# EAGLE schematic 1_axis_stepper_driver_teensy_v39 (EAGLE 9.7.0)
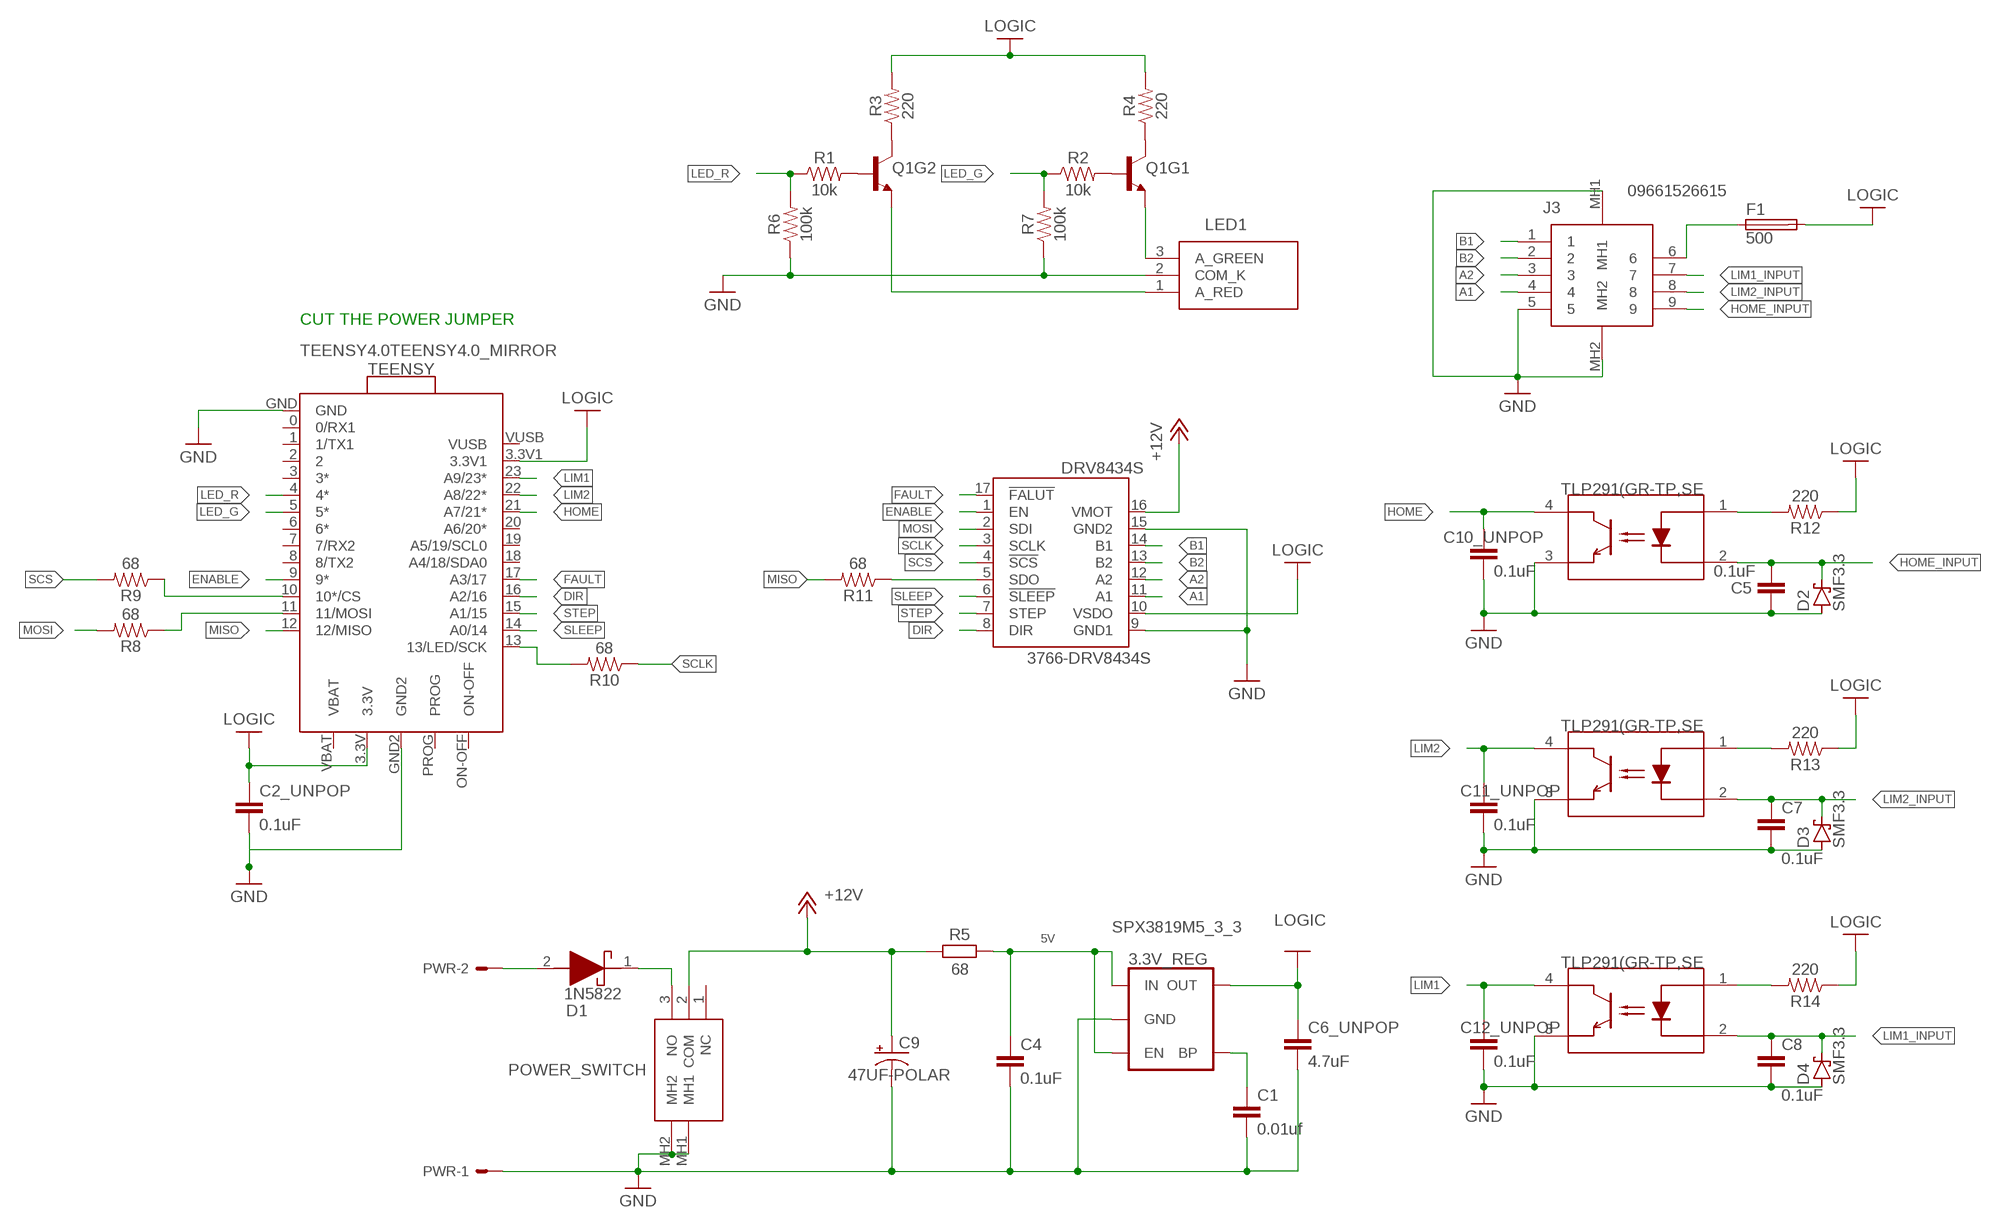
[diagram p0: schematic, sheet 1]

## Parts
3.3V_REG  SPX3819M5_3_3  V_REG_SPX3819-SOT23-5  [SOT23-5]
C1  0.01uf  0.1UF-0603-100V-10%  [0603]
C2_UNPOP  0.1uF  0.1UF-0603-100V-10%  [0603]
C4  0.1uF  0.1UF-0603-100V-10%  [0603]
C5  0.1uF  0.1UF-0603-100V-10%  [0603]
C6_UNPOP  4.7uF  4.7UF-0603-35V-(20%)  [0603]
C7  0.1uF  0.1UF-0603-100V-10%  [0603]
C8  0.1uF  0.1UF-0603-100V-10%  [0603]
C9  47UF-POLAR  47UF-POLAR-PANASONIC_D-50V-20%  [PANASONIC_D]
C10_UNPOP  0.1uF  0.1UF-0603-100V-10%  [0603]
C11_UNPOP  0.1uF  0.1UF-0603-100V-10%  [0603]
C12_UNPOP  0.1uF  0.1UF-0603-100V-10%  [0603]
D1  1N5822  [DIOAD3070W130L950D530]
D2  SMF3.3  SMF5.0AT1  [SOD123FL]
D3  SMF3.3  SMF5.0AT1  [SOD123FL]
D4  SMF3.3  SMF5.0AT1  [SOD123FL]
DRV8434S  3766-DRV8434S  [DRV8434S]
F1  500  FUSE_CHIP-0603(1608-METRIC)  [FUSC1608X60N]
J3  09661526615  [09661526615]
LED1  WP42WUM_EGW  [WP42WUMEGW]
POWER_SWITCH  200MSP1T2B2M6RE  [200MSP1T2B2M6RE]
PWR  22-27-2021-02  [6410-02]
Q1  TRANS_NPN_DUAL-MBT3904DW1T1  [SC70-6]
R1  10k  10KOHM-0603-1/10W-1%  [0603]
R2  10k  10KOHM-0603-1/10W-1%  [0603]
R3  220  220OHM-0603-1/10W-1%  [0603]
R4  220  220OHM-0603-1/10W-1%  [0603]
R5  68  R_CHIP-2512(6332-METRIC)  [RESC6332X71]
R6  100k  10KOHM-0603-1/10W-1%  [0603]
R7  100k  10KOHM-0603-1/10W-1%  [0603]
R8  68  10KOHM-0603-1/10W-1%  [0603]
R9  68  10KOHM-0603-1/10W-1%  [0603]
R10  68  10KOHM-0603-1/10W-1%  [0603]
R11  68  10KOHM-0603-1/10W-1%  [0603]
R12  220  10KOHM-0603-1/10W-1%  [0603]
R13  220  10KOHM-0603-1/10W-1%  [0603]
R14  220  10KOHM-0603-1/10W-1%  [0603]
TEENSY  TEENSY4.0TEENSY4.0_MIRROR  [TEENSY4.0_MIRROR]
U1  TLP291(GR-TP,SE  [TLP291(GR-TP,SE]
U2  TLP291(GR-TP,SE  [TLP291(GR-TP,SE]
U3  TLP291(GR-TP,SE  [TLP291(GR-TP,SE]

## Nets
5V [Logic Power]: 3.3V_REG.1(IN) 3.3V_REG.3(EN) C4.1 R5.2
+12V [Power]: C9.+ DRV8434S.16(VMOT) POWER_SWITCH.2(COM) R5.1
A1 [Power]: DRV8434S.11(A1) J3.4
A2 [Power]: DRV8434S.12(A2) J3.3
B1 [Power]: DRV8434S.14(B1) J3.1
B2 [Power]: DRV8434S.13(B2) J3.2
DCIN [Power]: D1.2(A) PWR.2
DCSAFE [Power]: D1.1(K) POWER_SWITCH.3(NO)
DIR: DRV8434S.8(DIR) TEENSY.16(A2/16)
ENABLE: DRV8434S.1(EN) TEENSY.9(9*)
FAULT: DRV8434S.17(!FALUT) TEENSY.17(A3/17)
GND [Logic Power]: 3.3V_REG.2(GND) C1.2 C2_UNPOP.2 C4.2 C5.2 C6_UNPOP.2 C7.2 C8.2 C9.- C10_UNPOP.2 C11_UNPOP.2 C12_UNPOP.2 D2.A D3.A D4.A DRV8434S.9(GND1) DRV8434S.15(GND2) J3.5 J3.MH1 J3.MH2 LED1.2(COM_K) POWER_SWITCH.MH1 POWER_SWITCH.MH2 PWR.1 R6.1 R7.1 TEENSY.GND TEENSY.GND2 U1.3(EMITTER) U2.3(EMITTER) U3.3(EMITTER)
HOME: C10_UNPOP.1 TEENSY.21(A7/21*) U1.4(COLLECTOR)
HOME_INPUT: C5.1 D2.C J3.9 U1.2(CATHODE)
LED_G: R2.1 R7.2 TEENSY.5(5*)
LED_R: R1.1 R6.2 TEENSY.4(4*)
LIM1: C12_UNPOP.1 TEENSY.23(A9/23*) U3.4(COLLECTOR)
LIM1_INPUT: C8.1 D4.C J3.7 U3.2(CATHODE)
LIM2: C11_UNPOP.1 TEENSY.22(A8/22*) U2.4(COLLECTOR)
LIM2_INPUT: C7.1 D3.C J3.8 U2.2(CATHODE)
LOGIC [Logic Power]: 3.3V_REG.5(OUT) C2_UNPOP.1 C6_UNPOP.1 DRV8434S.10(VSDO) F1.2 R3.2 R4.2 R12.1 R13.1 R14.1 TEENSY.3.3V TEENSY.3.3V1
MISO: R11.2 TEENSY.12(12/MISO)
MOSI: DRV8434S.2(SDI) R8.2
N$1: Q1.6(C) R3.1
N$2: LED1.1(A_RED) Q1.1(E)
N$3: Q1.2(B) R1.2
N$4: Q1.5(B) R2.2
N$5: Q1.3(C) R4.1
N$6: LED1.3(A_GREEN) Q1.4(E)
N$7 [Logic Power]: F1.1 J3.6
N$8: 3.3V_REG.4(BP) C1.1
N$9: R8.1 TEENSY.11(11/MOSI)
N$10: R9.1 TEENSY.10(10*/CS)
N$11: R10.2 TEENSY.13(13/LED/SCK)
N$12: DRV8434S.5(SDO) R11.1
N$13: R12.2 U1.1(ANODE)
N$14: R13.2 U2.1(ANODE)
N$15: R14.2 U3.1(ANODE)
SCLK: DRV8434S.3(SCLK) R10.1
SCS: DRV8434S.4(!SCS) R9.2
SLEEP: DRV8434S.6(!SLEEP) TEENSY.14(A0/14)
STEP: DRV8434S.7(STEP) TEENSY.15(A1/15)
Unconnected: POWER_SWITCH.1(NC) TEENSY.0(0/RX1) TEENSY.1(1/TX1) TEENSY.2 TEENSY.3(3*) TEENSY.6(6*) TEENSY.7(7/RX2) TEENSY.8(8/TX2) TEENSY.18(A4/18/SDA0) TEENSY.19(A5/19/SCL0) TEENSY.20(A6/20*) TEENSY.ON-OFF TEENSY.PROG

## Notes on the sheet
- CUT THE POWER JUMPER

## Power pins joined to a net without a drawn wire
VBAT: TEENSY.VBAT
VUSB: TEENSY.VUSB

## Library data of the parts
3.3V_REG = SparkFun-IC-Power:V_REG_SPX3819: SPX3819 Voltage Regulator 3.3V 500mA, 16V input Datasheet <https://www.exar.com/content/document.ashx?id=22106> SparkFun Products: SparkFun Serial Controlled Motor Driver <https://www.sparkfun.com/products/13911>; PROD_ID: VREG-13321
C1 = SparkFun-Capacitors:0.1UF: 0.1µF ceramic capacitors A capacitor is a passive two-terminal electrical component used to store electrical energy temporarily in an electric field.; PROD_ID: CAP-08390; VALUE: 0.1uF
C2_UNPOP C4 C5 C7 C8 C10_UNPOP C11_UNPOP C12_UNPOP = SparkFun-Capacitors:0.1UF: 0.1µF ceramic capacitors A capacitor is a passive two-terminal electrical component used to store electrical energy temporarily in an electric field.; PROD_ID: CAP-08390
C6_UNPOP = SparkFun-Capacitors:4.7UF: 4.7µF ceramic capacitors A capacitor is a passive two-terminal electrical component used to store electrical energy temporarily in an electric field.; PROD_ID: CAP-14106
C9 = SparkFun-Capacitors:47UF-POLAR: 47µF polarized capacitors A capacitor is a passive two-terminal electrical component used to store electrical energy temporarily in an electric field.; PROD_ID: CAP-10547
D1 = 1N5822:1N5822: Schottky Diodes Source: Datasheet <http://www.st.com/web/en/resource/technical/document/datasheet/CD00001626.pdf>; DESCRIPTION: Schottky Diodes; HEIGHT: mm; MANUFACTURER_NAME: STMicroelectronics; MANUFACTURER_PART_NUMBER: 1N5822; MOUSER_PART_NUMBER: 511-1N5822; MOUSER_PRICE-STOCK: https://www.mouser.co.uk/ProductDetail/STMicroelectronics/1N5822?qs=JV7lzlMm3yJ50hlrGV6%252BnQ%3D%3D
D2-D4 = diode:SMF5.0AT1: 200 W Transient Voltage Suppressor Source: Data sheet <http://www.onsemi.com/pub_link/Collateral/SMF5.0AT1-D.PDF>
DRV8434S = pololu-stepper-driver:3766-DRV8434S: DRV8434S Stepper Motor Driver Carrier; SPI 2A Max Current (Header Pins Soldered) https://www.pololu.com/product/3766
F1 = Circuit-Protection:FUSE: Fuse - Generic; CATEGORY: Circuit-Protection; SUB-CATEGORY: Fuse
J3 = 09661526615:09661526615: D-Sub 9pin female low profile angled, 2.54mm pitch, stamped, with board locks, M3, PL2 Source: Datasheet <https://b2b.harting.com/files/download/PRD/PDF_DS/PDF_DS_09661526615_EN.pdf>; DESCRIPTION: D-Sub 9pin female low profile angled, 2.54mm pitch, stamped, with board locks, M3, PL2; HEIGHT: 12.5mm; MANUFACTURER_NAME: HARTING; MANUFACTURER_PART_NUMBER: 09661526615; MOUSER_PART_NUMBER: 617-09661526615; MOUSER_PRICE-STOCK: https://www.mouser.co.uk/ProductDetail/HARTING/09661526615?qs=vMzbrHvTwPGeGx6%252Be%2Fu2sw%3D%3D
LED1 = WP42WUM_EGW:WP42WUM_EGW: LED Circuit Board Indicators Red Grn 625 568nm White Diffused Source: Datasheet <http://www.kingbrightusa.com/images/catalog/SPEC/WP42WUM-EGW.pdf>; DESCRIPTION: LED Circuit Board Indicators Red Grn 625 568nm White Diffused; HEIGHT: 7.36mm; MANUFACTURER_NAME: Kingbright; MANUFACTURER_PART_NUMBER: WP42WUM/EGW; MOUSER_PART_NUMBER: 604-WP42WUM/EGW; MOUSER_PRICE-STOCK: https://www.mouser.co.uk/ProductDetail/Kingbright/WP42WUM-EGW?qs=58z0TXQGVSSWjxfnBzIG6A%3D%3D
POWER_SWITCH = 200MSP1T2B2M6RE:200MSP1T2B2M6RE: TOGGLE, 0.4VA, 20VAC/VDC SPDT, On-On Through Hole, Right Angle Source: Datasheet <https://configured-product-images.s3.amazonaws.com/2D/specs/200MSP1T2B2M6RE.pdf>; DESCRIPTION: TOGGLE, 0.4VA, 20VAC/VDC SPDT, On-On Through Hole, Right Angle; HEIGHT: 6.35mm; MANUFACTURER_NAME: E-Switch; MANUFACTURER_PART_NUMBER: 200MSP1T2B2M6RE; MOUSER_PART_NUMBER: 612-200-A2262; MOUSER_PRICE-STOCK: https://www.mouser.co.uk/ProductDetail/E-Switch/200MSP1T2B2M6RE?qs=7Bi7Dg8SEnwpN43jZS7hJQ%3D%3D
PWR = con-molex:22-?-02: CONNECTOR wire to board 2.54 mm (.1 inch) pitch header; MF: MOLEX; OC_FARNELL: unknown; OC_NEWARK: unknown
Q1 = SparkFun-DiscreteSemi:TRANS_NPN_DUAL: Dual NPN Transistors in Single Package The MBT3904W1 puts two general purpose 3904 NPN transistors in a single package. Datasheet <http://www.onsemi.com/pub_link/Collateral/MBT3904DW1T1-D.PDF> SparkFun Products: SparkFun ESP32 Thing <https://www.sparkfun.com/products/13907>; PROD_ID: TRANS-13337
R1 R2 = SparkFun-Resistors:10KOHM: 10kΩ resistor A resistor is a passive two-terminal electrical component that implements electrical resistance as a circuit element. Resistors act to reduce current flow, and, at the same time, act to lower voltage levels within circuits. - Wikipedia; PROD_ID: RES-00824
R3 R4 = SparkFun-Resistors:220OHM: 220Ω resistor A resistor is a passive two-terminal electrical component that implements electrical resistance as a circuit element. Resistors act to reduce current flow, and, at the same time, act to lower voltage levels within circuits. - Wikipedia; PROD_ID: RES-07861
R5 = Resistor:R: Resistor Fixed - Generic; CATEGORY: Resistor; SUB-CATEGORY: Fixed
R6-R14 = SparkFun-Resistors:10KOHM: 10kΩ resistor A resistor is a passive two-terminal electrical component that implements electrical resistance as a circuit element. Resistors act to reduce current flow, and, at the same time, act to lower voltage levels within circuits. - Wikipedia; PROD_ID: RES-00824; VALUE: 10k
TEENSY = SparkFun-Boards:TEENSY4.0: Teensy Footprint Mechanical footprint with connectors for Teensy Development Board with ARM Cortex. SparkFun Products: Teensy 4.0 <https://www.sparkfun.com/products/15583> Teensy 4.0 (with Headers) <https://www.sparkfun.com/products/16997> Teensy 3.2 <https://www.sparkfun.com/products/13736> Teensy LC <https://www.sparkfun.com/products/13305> SparkFun Qwiic Shield for Teensy <https://www.sparkfun.com/products/17119> Teensy Header Kit <https://www.sparkfun.com/products/13925>
U1-U3 = OPTOISOLATOR:TLP291(GR-TP,SE: Optoisolator Transistor Output 5000Vrms 1 Channel 6-SO Manufacturer's datasheet <https://www.digikey.com/products/en?keywords=TLP291(GR-TPSECT-ND>; CREATED_BY: PCBLayout.com; DIGIKEY_PART_NUMBER: TLP291(GR-TPSECT-ND; MANUFACTURER: Toshiba Semiconductor and Storage; MPN: TLP291(GR-TP,SE; PACKAGE: 4-SO

## Net classes
0 default: clearance 0.178 mm
1 Power: width 0.305 mm, clearance 0.406 mm
2 Logic Power: clearance 0.178 mm